# EAGLE schematic Lineboard (EAGLE 9.6.2)

## Sheet 1 of 3: Multiplexer and Connectors
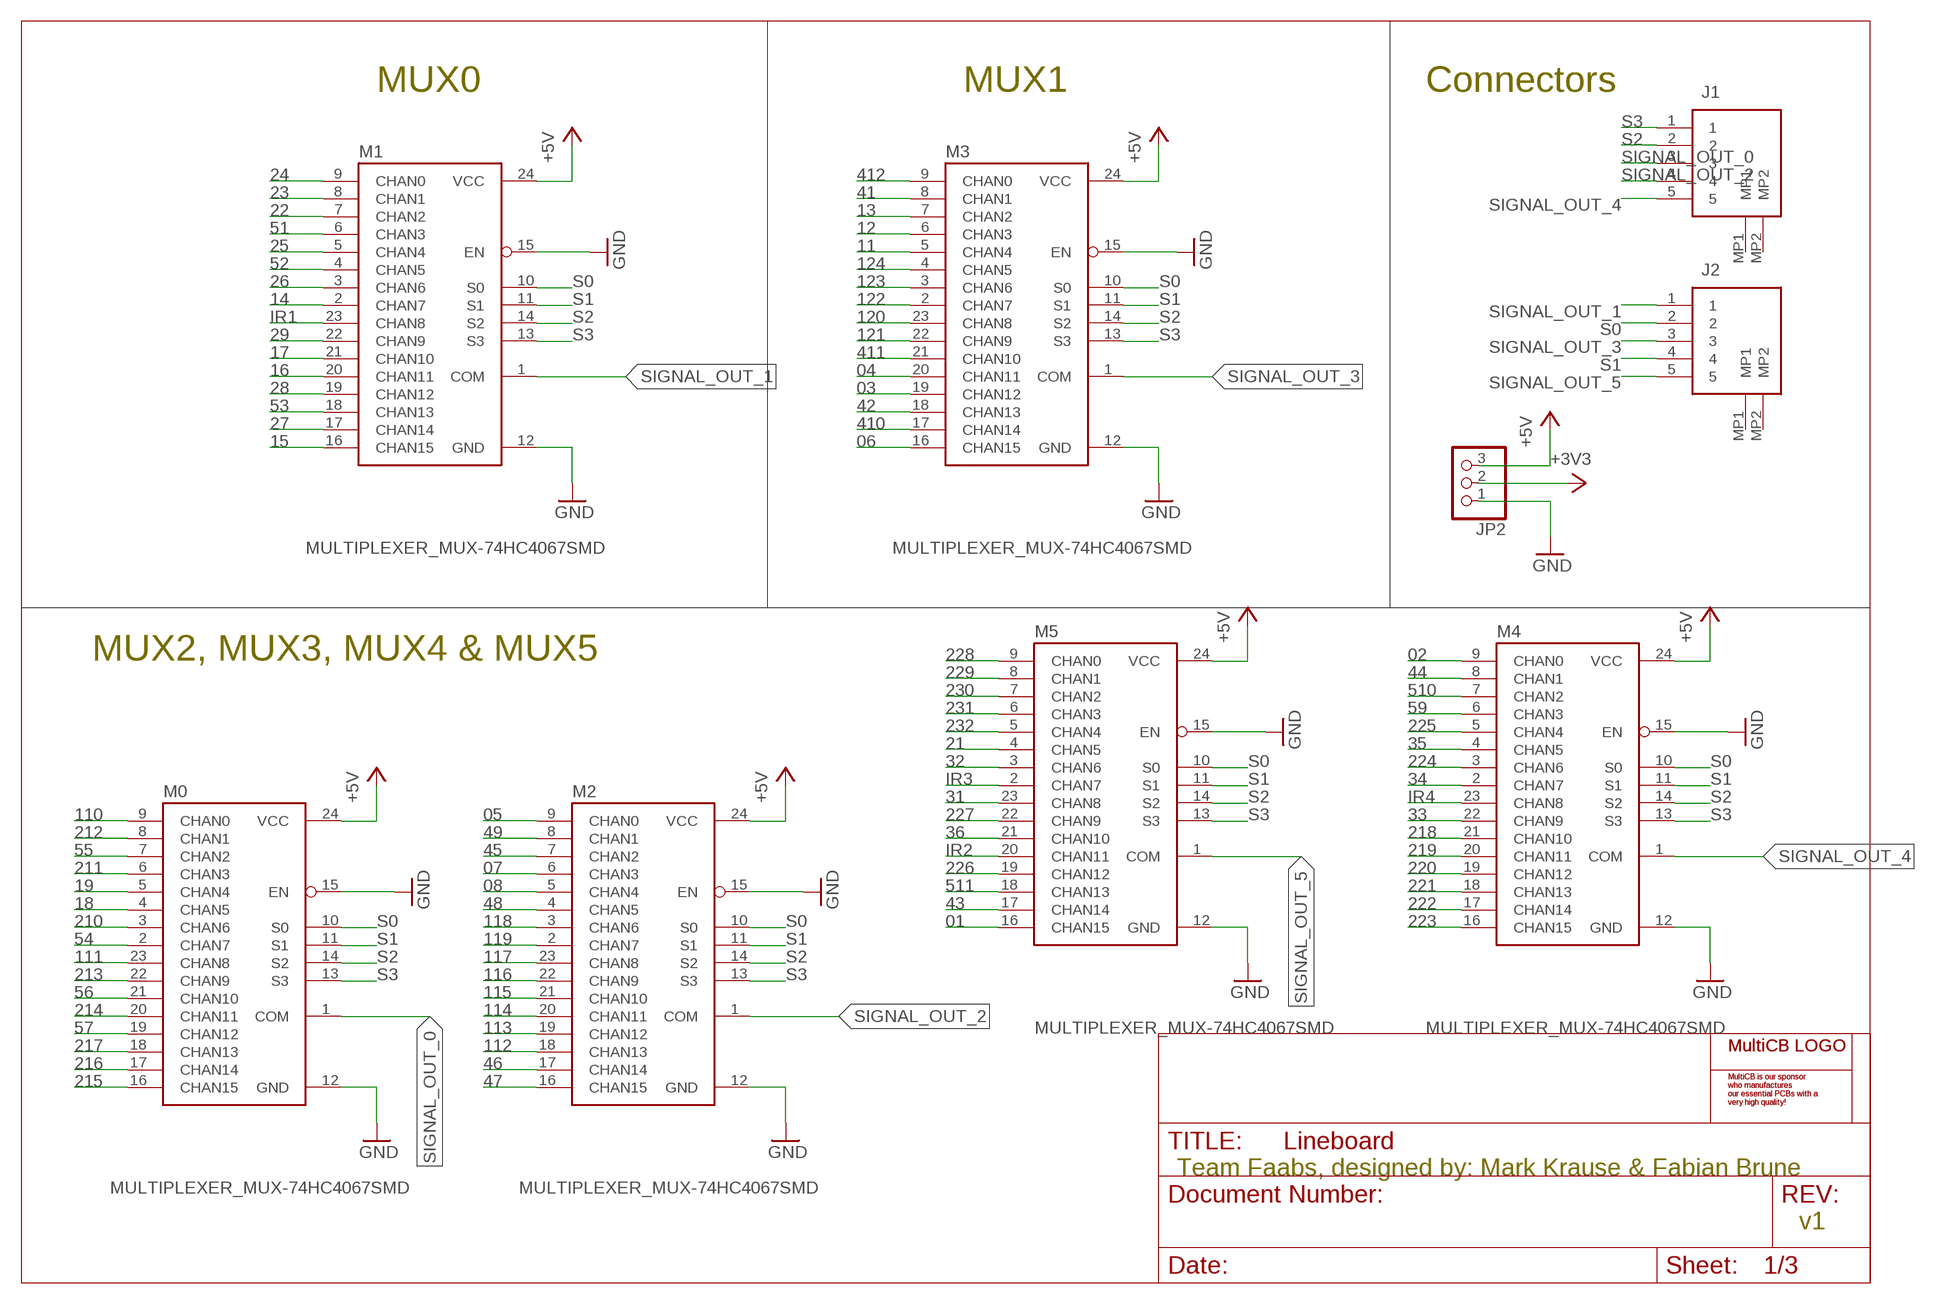
[diagram p0: schematic, sheet 1]

### Parts
J1  5PIN_1MM_CON  [2035600503]
J2  5PIN_1MM_CON  [2035600503]
JP2  PINHD-1X3  [1X03]
M0  MULTIPLEXER_MUX-74HC4067SMD  [SPARKFUN_SSOP24]
M1  MULTIPLEXER_MUX-74HC4067SMD  [SPARKFUN_SSOP24]
M2  MULTIPLEXER_MUX-74HC4067SMD  [SPARKFUN_SSOP24]
M3  MULTIPLEXER_MUX-74HC4067SMD  [SPARKFUN_SSOP24]
M4  MULTIPLEXER_MUX-74HC4067SMD  [SPARKFUN_SSOP24]
M5  MULTIPLEXER_MUX-74HC4067SMD  [SPARKFUN_SSOP24]
U$1  MULTICB_LOGOSTANDART  [SMALL_STANDARTLOGO_28MM]
U$5  MULTICB_LOGOSTANDART  [SMALL_STANDARTLOGO_28MM]

### Nets
01: M5.16(CHAN15) ; also sheet 3
02: M4.9(CHAN0) ; also sheet 3
03: M3.19(CHAN12) ; also sheet 3
04: M3.20(CHAN11) ; also sheet 3
05: M2.9(CHAN0) ; also sheet 3
06: M3.16(CHAN15) ; also sheet 3
07: M2.6(CHAN3) ; also sheet 3
08: M2.5(CHAN4) ; also sheet 3
11: M3.5(CHAN4) ; also sheet 3
12: M3.6(CHAN3) ; also sheet 3
13: M3.7(CHAN2) ; also sheet 3
14: M1.2(CHAN7) ; also sheet 3
15: M1.16(CHAN15) ; also sheet 3
16: M1.20(CHAN11) ; also sheet 3
17: M1.21(CHAN10) ; also sheet 3
18: M0.4(CHAN5) ; also sheet 3
19: M0.5(CHAN4) ; also sheet 3
21: M5.4(CHAN5) ; also sheet 3
22: M1.7(CHAN2) ; also sheet 3
23: M1.8(CHAN1) ; also sheet 3
24: M1.9(CHAN0) ; also sheet 3
25: M1.5(CHAN4) ; also sheet 3
26: M1.3(CHAN6) ; also sheet 3
27: M1.17(CHAN14) ; also sheet 3
28: M1.19(CHAN12) ; also sheet 3
29: M1.22(CHAN9) ; also sheet 3
31: M5.23(CHAN8) ; also sheet 3
32: M5.3(CHAN6) ; also sheet 3
33: M4.22(CHAN9) ; also sheet 3
34: M4.2(CHAN7) ; also sheet 3
35: M4.4(CHAN5) ; also sheet 3
36: M5.21(CHAN10) ; also sheet 3
41: M3.8(CHAN1) ; also sheet 3
42: M3.18(CHAN13) ; also sheet 3
43: M5.17(CHAN14) ; also sheet 3
44: M4.8(CHAN1) ; also sheet 3
45: M2.7(CHAN2) ; also sheet 3
46: M2.17(CHAN14) ; also sheet 3
47: M2.16(CHAN15) ; also sheet 3
48: M2.4(CHAN5) ; also sheet 3
49: M2.8(CHAN1) ; also sheet 3
51: M1.6(CHAN3) ; also sheet 3
52: M1.4(CHAN5) ; also sheet 3
53: M1.18(CHAN13) ; also sheet 3
54: M0.2(CHAN7) ; also sheet 3
55: M0.7(CHAN2) ; also sheet 3
56: M0.21(CHAN10) ; also sheet 3
57: M0.19(CHAN12) ; also sheet 3
59: M4.6(CHAN3) ; also sheet 3
110: M0.9(CHAN0) ; also sheet 3
111: M0.23(CHAN8) ; also sheet 3
112: M2.18(CHAN13) ; also sheet 3
113: M2.19(CHAN12) ; also sheet 3
114: M2.20(CHAN11) ; also sheet 3
115: M2.21(CHAN10) ; also sheet 3
116: M2.22(CHAN9) ; also sheet 3
117: M2.23(CHAN8) ; also sheet 3
118: M2.3(CHAN6) ; also sheet 3
119: M2.2(CHAN7) ; also sheet 3
120: M3.23(CHAN8) ; also sheet 3
121: M3.22(CHAN9) ; also sheet 3
122: M3.2(CHAN7) ; also sheet 3
123: M3.3(CHAN6) ; also sheet 3
124: M3.4(CHAN5) ; also sheet 3
210: M0.3(CHAN6) ; also sheet 3
211: M0.6(CHAN3) ; also sheet 3
212: M0.8(CHAN1) ; also sheet 3
213: M0.22(CHAN9) ; also sheet 3
214: M0.20(CHAN11) ; also sheet 3
215: M0.16(CHAN15) ; also sheet 3
216: M0.17(CHAN14) ; also sheet 3
217: M0.18(CHAN13) ; also sheet 3
218: M4.21(CHAN10) ; also sheet 3
219: M4.20(CHAN11) ; also sheet 3
220: M4.19(CHAN12) ; also sheet 3
221: M4.18(CHAN13) ; also sheet 3
222: M4.17(CHAN14) ; also sheet 3
223: M4.16(CHAN15) ; also sheet 3
224: M4.3(CHAN6) ; also sheet 3
225: M4.5(CHAN4) ; also sheet 3
226: M5.19(CHAN12) ; also sheet 3
227: M5.22(CHAN9) ; also sheet 3
228: M5.9(CHAN0) ; also sheet 3
229: M5.8(CHAN1) ; also sheet 3
230: M5.7(CHAN2) ; also sheet 3
231: M5.6(CHAN3) ; also sheet 3
232: M5.5(CHAN4) ; also sheet 3
410: M3.17(CHAN14) ; also sheet 3
411: M3.21(CHAN10) ; also sheet 3
412: M3.9(CHAN0) ; also sheet 3
510: M4.7(CHAN2) ; also sheet 3
511: M5.18(CHAN13) ; also sheet 3
+3V3: JP2.2 ; also sheet 2,3
+5V: JP2.3 M0.24(VCC) M1.24(VCC) M2.24(VCC) M3.24(VCC) M4.24(VCC) M5.24(VCC) ; also sheet 2
GND: JP2.1 M0.12(GND) M0.15(EN) M1.12(GND) M1.15(EN) M2.12(GND) M2.15(EN) M3.12(GND) M3.15(EN) M4.12(GND) M4.15(EN) M5.12(GND) M5.15(EN) ; also sheet 2,3
IR1: M1.23(CHAN8) ; also sheet 2
IR2: M5.20(CHAN11) ; also sheet 2
IR3: M5.2(CHAN7) ; also sheet 2
IR4: M4.23(CHAN8) ; also sheet 2
S0: J2.2 M0.10(S0) M1.10(S0) M2.10(S0) M3.10(S0) M4.10(S0) M5.10(S0)
S1: J2.4 M0.11(S1) M1.11(S1) M2.11(S1) M3.11(S1) M4.11(S1) M5.11(S1)
S2: J1.2 M0.14(S2) M1.14(S2) M2.14(S2) M3.14(S2) M4.14(S2) M5.14(S2)
S3: J1.1 M0.13(S3) M1.13(S3) M2.13(S3) M3.13(S3) M4.13(S3) M5.13(S3)
SIGNAL_OUT_0: J1.3 M0.1(COM)
SIGNAL_OUT_1: J2.1 M1.1(COM)
SIGNAL_OUT_2: J1.4 M2.1(COM)
SIGNAL_OUT_3: J2.3 M3.1(COM)
SIGNAL_OUT_4: J1.5 M4.1(COM)
SIGNAL_OUT_5: J2.5 M5.1(COM)
Unconnected: J1.MP1 J1.MP2 J2.MP1 J2.MP2

### Notes on the sheet
- MUX0 | MUX1 | Connectors
- MUX2, MUX3, MUX4 & MUX5
- Team Faabs, designed by: Mark Krause & Fabian Brune
- v1

## Sheet 2 of 3: IR-Phototransistors
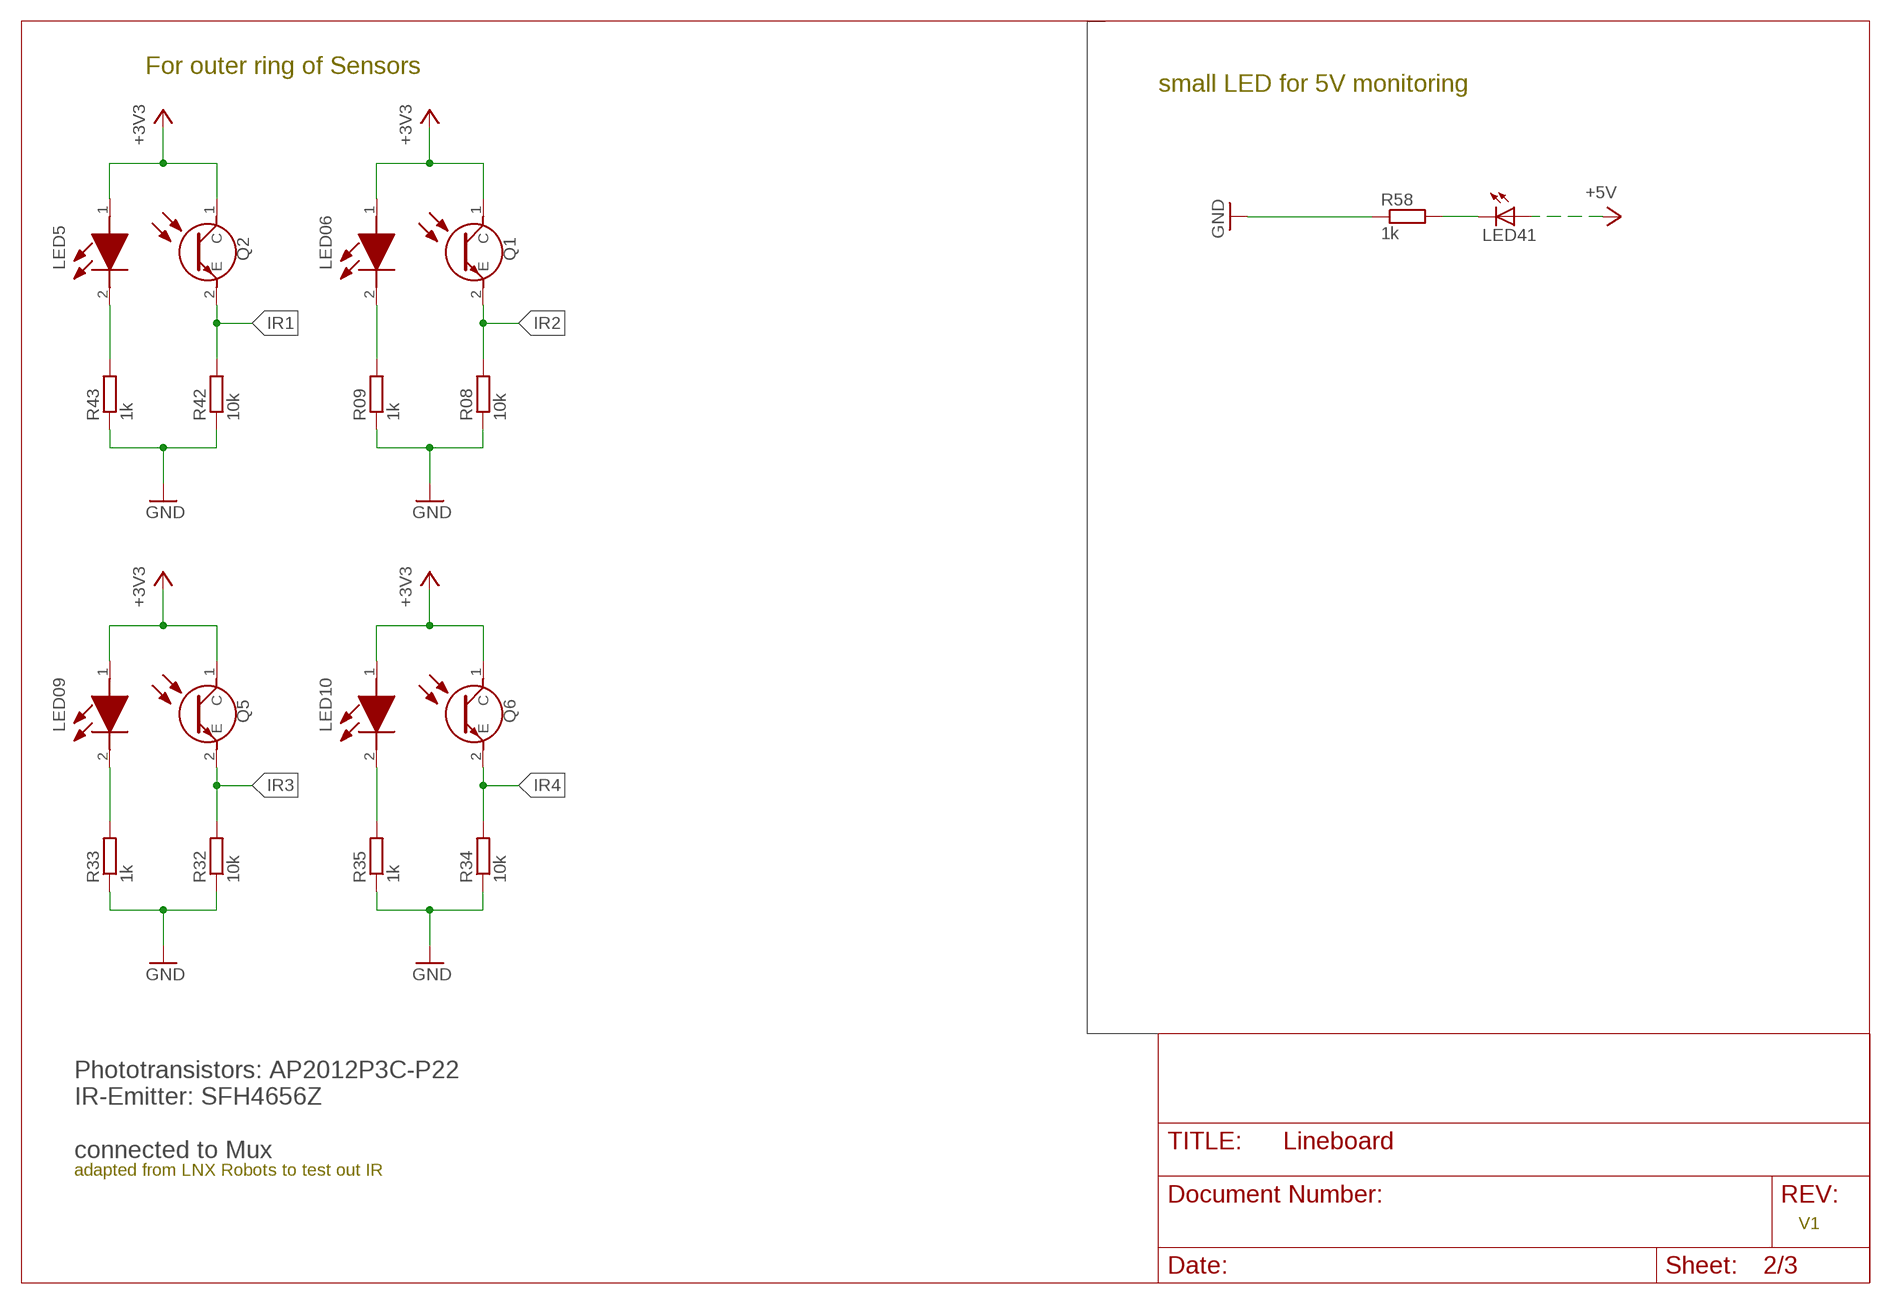
[diagram p1: schematic, sheet 2]

### Parts
LED5  SFH_4656-Z  [SFH4656Z]
LED06  SFH_4656-Z  [SFH4656Z]
LED09  SFH_4656-Z  [SFH4656Z]
LED10  SFH_4656-Z  [SFH4656Z]
LED41  POWER_LED-GREEN-CHIPLED_0805  [POWER_DISTRIBUTION_CHIPLED_0805]
Q1  AP2012P3C-P22  [AP2012P3CP22]
Q2  AP2012P3C-P22  [AP2012P3CP22]
Q5  AP2012P3C-P22  [AP2012P3CP22]
Q6  AP2012P3C-P22  [AP2012P3CP22]
R08  10k  R-EU_R0603  [R0603]
R09  1k  R-EU_R0603  [R0603]
R32  10k  R-EU_R0603  [R0603]
R33  1k  R-EU_R0603  [R0603]
R34  10k  R-EU_R0603  [R0603]
R35  1k  R-EU_R0603  [R0603]
R42  10k  R-EU_R0603  [R0603]
R43  1k  R-EU_R0603  [R0603]
R58  1k  R-EU_R0603  [R0603]

### Nets
+3V3: LED5.1(A) LED06.1(A) LED09.1(A) LED10.1(A) Q1.1(C) Q2.1(C) Q5.1(C) Q6.1(C) ; also sheet 1,3
+5V: LED41.A ; also sheet 1
GND: R08.1 R09.1 R32.1 R33.1 R34.1 R35.1 R42.1 R43.1 R58.1 ; also sheet 1,3
IR1: Q2.2(E) R42.2 ; also sheet 1
IR2: Q1.2(E) R08.2 ; also sheet 1
IR3: Q5.2(E) R32.2 ; also sheet 1
IR4: Q6.2(E) R34.2 ; also sheet 1
N$36: LED06.2(K) R09.2
N$37: LED5.2(K) R43.2
N$40: LED09.2(K) R33.2
N$41: LED10.2(K) R35.2
N$45: LED41.C R58.2

### Notes on the sheet
- For outer ring of Sensors
- small LED for 5V monitoring
- Phototransistors: AP2012P3C-P22
  IR-Emitter: SFH4656Z
  
  connected to Mux
- adapted from LNX Robots to test out IR
- V1

## Sheet 3 of 3: LED-Photostransistors
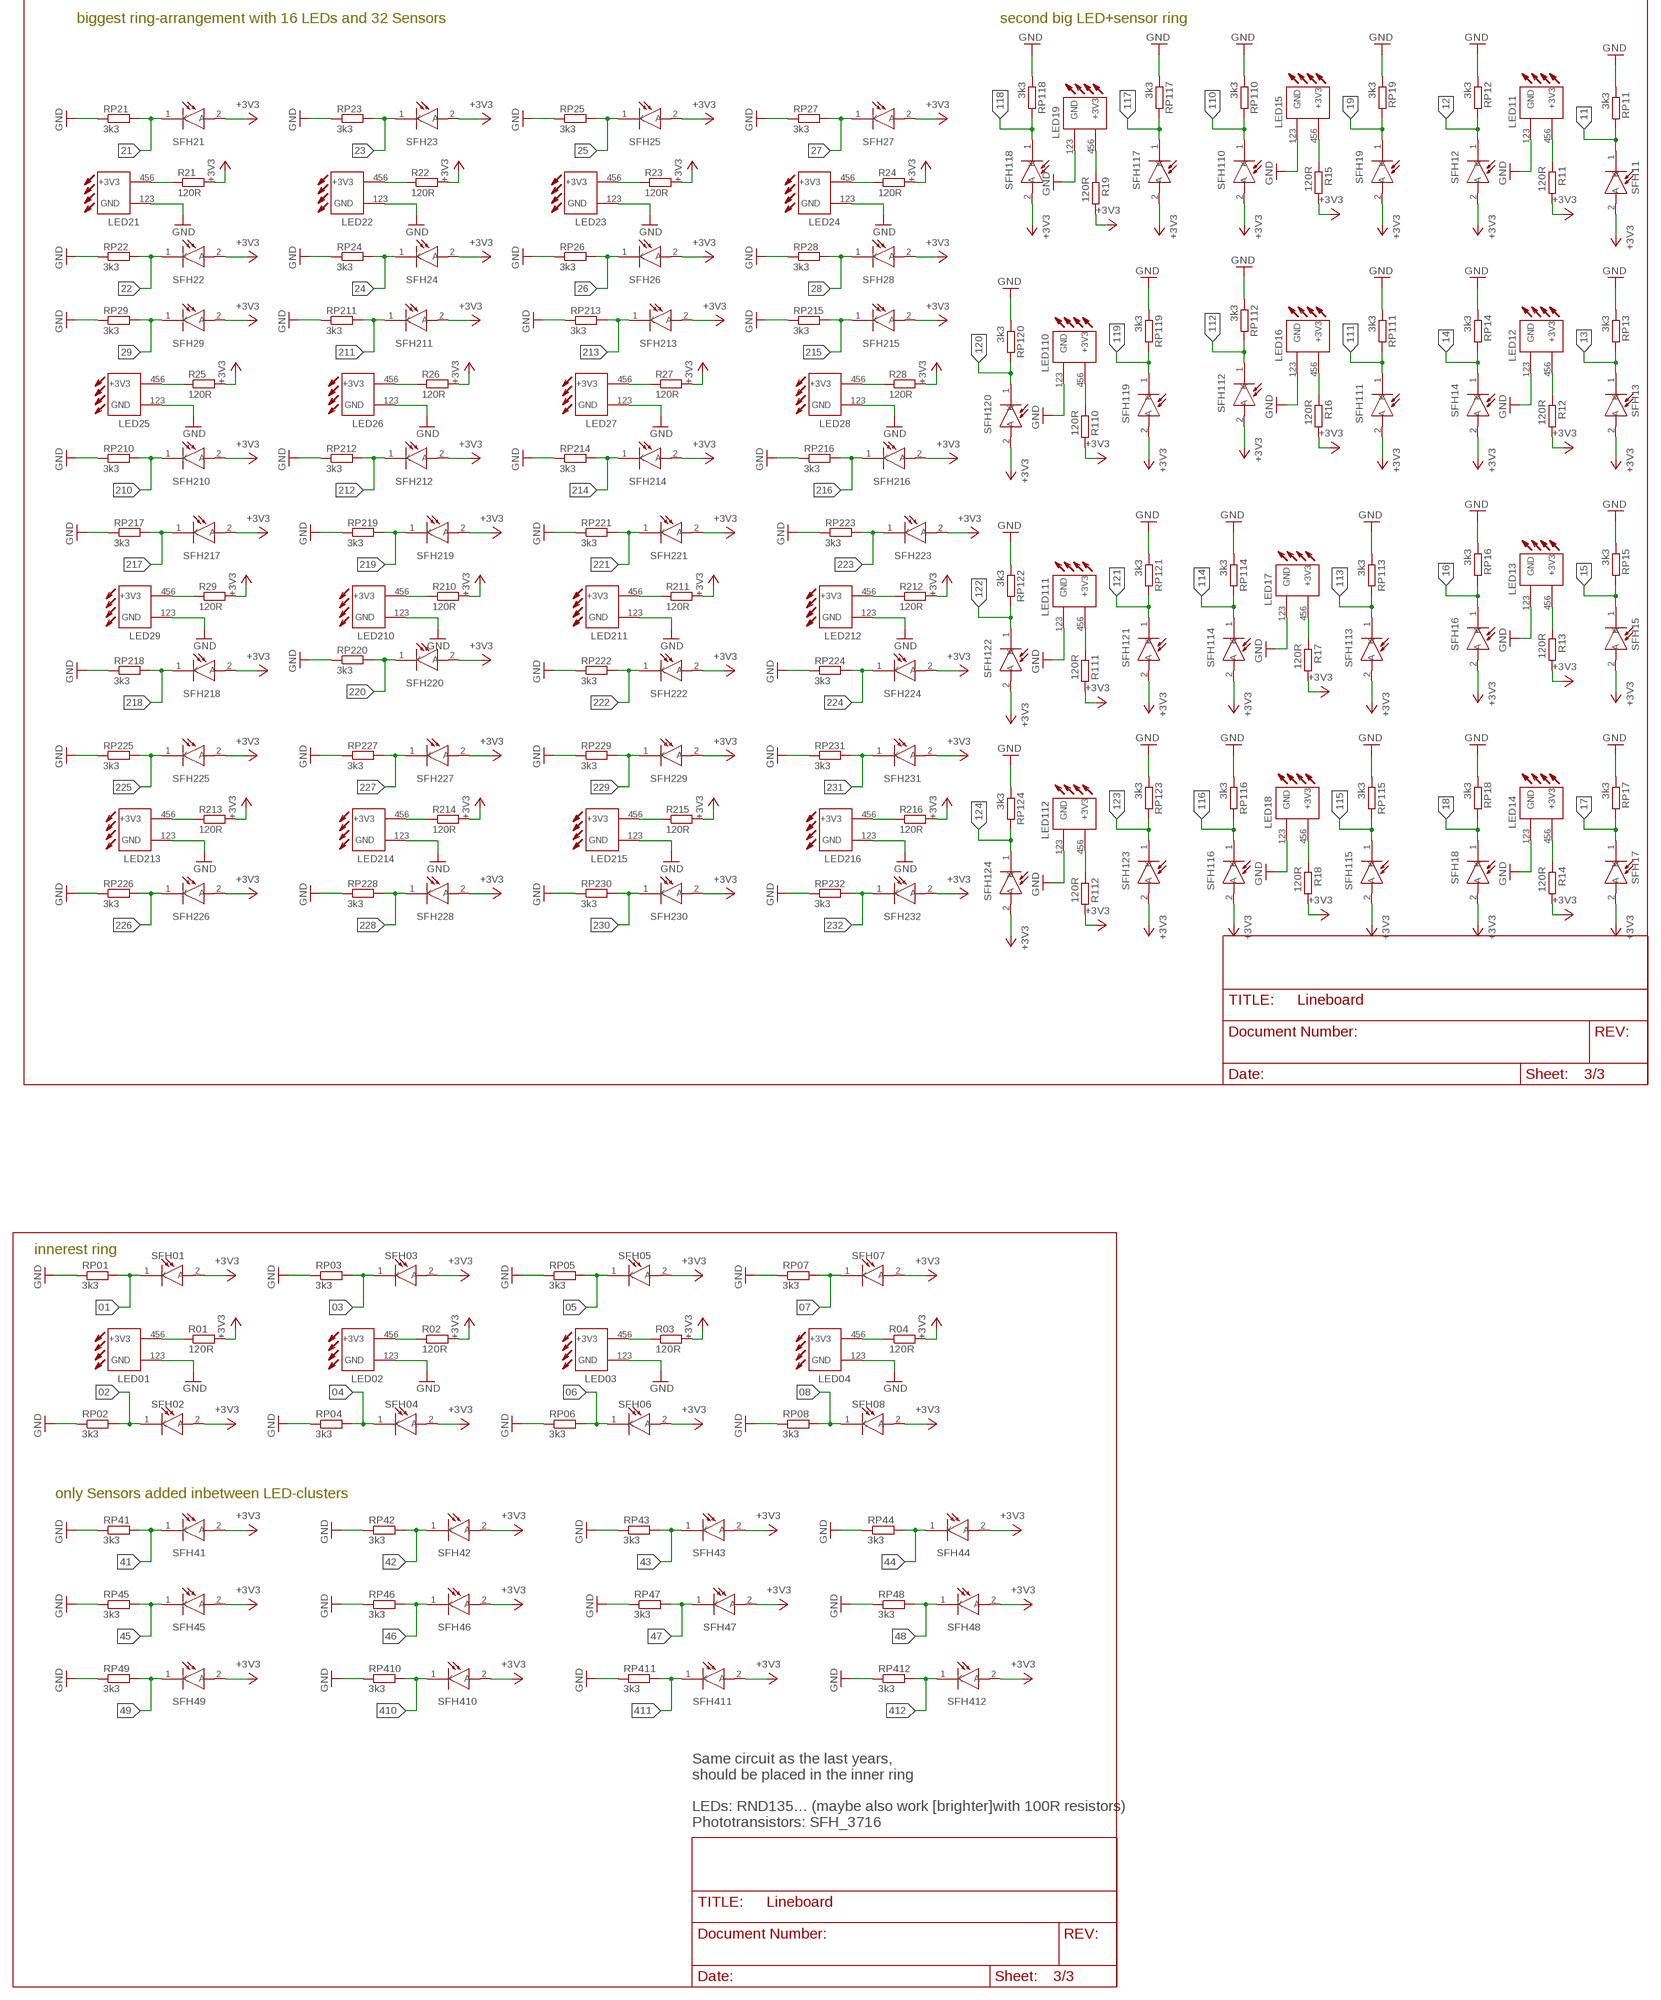
[diagram p2: schematic, sheet 3, part 1 of 2]
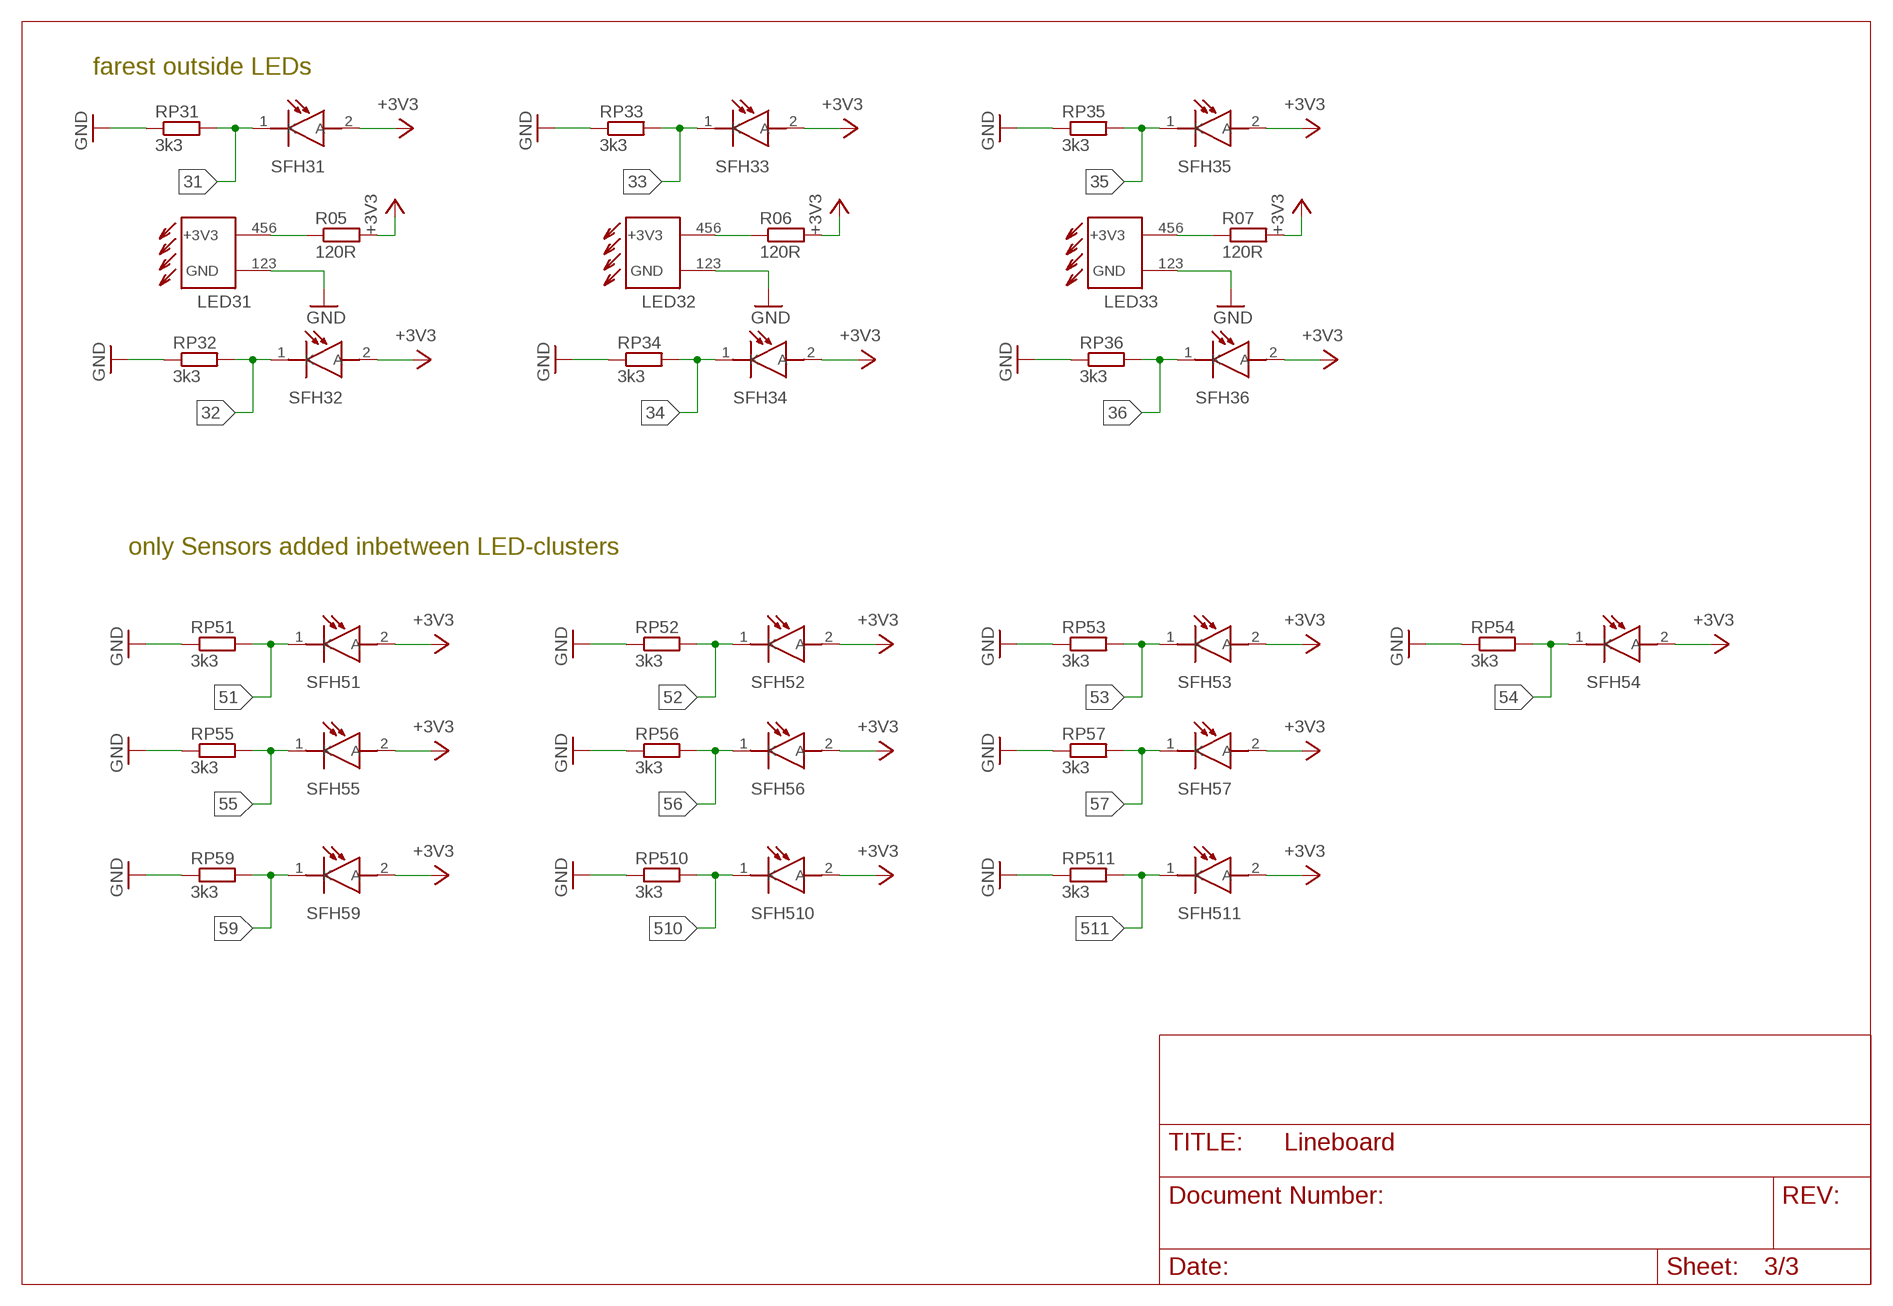
[diagram p3: schematic, sheet 3, part 2 of 2]

### Parts
LED01  RND135-00056LEDD  [LED]
LED02  RND135-00056LEDD  [LED]
LED03  RND135-00056LEDD  [LED]
LED04  RND135-00056LEDD  [LED]
LED11  RND135-00056LEDD  [LED]
LED12  RND135-00056LEDD  [LED]
LED13  RND135-00056LEDD  [LED]
LED14  RND135-00056LEDD  [LED]
LED15  RND135-00056LEDD  [LED]
LED16  RND135-00056LEDD  [LED]
LED17  RND135-00056LEDD  [LED]
LED18  RND135-00056LEDD  [LED]
LED19  RND135-00056LEDD  [LED]
LED21  RND135-00056LEDD  [LED]
LED22  RND135-00056LEDD  [LED]
LED23  RND135-00056LEDD  [LED]
LED24  RND135-00056LEDD  [LED]
LED25  RND135-00056LEDD  [LED]
LED26  RND135-00056LEDD  [LED]
LED27  RND135-00056LEDD  [LED]
LED28  RND135-00056LEDD  [LED]
LED29  RND135-00056LEDD  [LED]
LED31  RND135-00056LEDD  [LED]
LED32  RND135-00056LEDD  [LED]
LED33  RND135-00056LEDD  [LED]
LED110  RND135-00056LEDD  [LED]
LED111  RND135-00056LEDD  [LED]
LED112  RND135-00056LEDD  [LED]
LED210  RND135-00056LEDD  [LED]
LED211  RND135-00056LEDD  [LED]
LED212  RND135-00056LEDD  [LED]
LED213  RND135-00056LEDD  [LED]
LED214  RND135-00056LEDD  [LED]
LED215  RND135-00056LEDD  [LED]
LED216  RND135-00056LEDD  [LED]
R01  120R  R-EU_R0603  [R0603]
R02  120R  R-EU_R0603  [R0603]
R03  120R  R-EU_R0603  [R0603]
R04  120R  R-EU_R0603  [R0603]
R05  120R  R-EU_R0603  [R0603]
R06  120R  R-EU_R0603  [R0603]
R07  120R  R-EU_R0603  [R0603]
R11  120R  R-EU_R0603  [R0603]
R12  120R  R-EU_R0603  [R0603]
R13  120R  R-EU_R0603  [R0603]
R14  120R  R-EU_R0603  [R0603]
R15  120R  R-EU_R0603  [R0603]
R16  120R  R-EU_R0603  [R0603]
R17  120R  R-EU_R0603  [R0603]
R18  120R  R-EU_R0603  [R0603]
R19  120R  R-EU_R0603  [R0603]
R21  120R  R-EU_R0603  [R0603]
R22  120R  R-EU_R0603  [R0603]
R23  120R  R-EU_R0603  [R0603]
R24  120R  R-EU_R0603  [R0603]
R25  120R  R-EU_R0603  [R0603]
R26  120R  R-EU_R0603  [R0603]
R27  120R  R-EU_R0603  [R0603]
R28  120R  R-EU_R0603  [R0603]
R29  120R  R-EU_R0603  [R0603]
R110  120R  R-EU_R0603  [R0603]
R111  120R  R-EU_R0603  [R0603]
R112  120R  R-EU_R0603  [R0603]
R210  120R  R-EU_R0603  [R0603]
R211  120R  R-EU_R0603  [R0603]
R212  120R  R-EU_R0603  [R0603]
R213  120R  R-EU_R0603  [R0603]
R214  120R  R-EU_R0603  [R0603]
R215  120R  R-EU_R0603  [R0603]
R216  120R  R-EU_R0603  [R0603]
RP01  3k3  R-EU_R0603  [R0603]
RP02  3k3  R-EU_R0603  [R0603]
RP03  3k3  R-EU_R0603  [R0603]
RP04  3k3  R-EU_R0603  [R0603]
RP05  3k3  R-EU_R0603  [R0603]
RP06  3k3  R-EU_R0603  [R0603]
RP07  3k3  R-EU_R0603  [R0603]
RP08  3k3  R-EU_R0603  [R0603]
RP11  3k3  R-EU_R0603  [R0603]
RP12  3k3  R-EU_R0603  [R0603]
RP13  3k3  R-EU_R0603  [R0603]
RP14  3k3  R-EU_R0603  [R0603]
RP15  3k3  R-EU_R0603  [R0603]
RP16  3k3  R-EU_R0603  [R0603]
RP17  3k3  R-EU_R0603  [R0603]
RP18  3k3  R-EU_R0603  [R0603]
RP19  3k3  R-EU_R0603  [R0603]
RP21  3k3  R-EU_R0603  [R0603]
RP22  3k3  R-EU_R0603  [R0603]
RP23  3k3  R-EU_R0603  [R0603]
RP24  3k3  R-EU_R0603  [R0603]
RP25  3k3  R-EU_R0603  [R0603]
RP26  3k3  R-EU_R0603  [R0603]
RP27  3k3  R-EU_R0603  [R0603]
RP28  3k3  R-EU_R0603  [R0603]
RP29  3k3  R-EU_R0603  [R0603]
RP31  3k3  R-EU_R0603  [R0603]
RP32  3k3  R-EU_R0603  [R0603]
RP33  3k3  R-EU_R0603  [R0603]
RP34  3k3  R-EU_R0603  [R0603]
RP35  3k3  R-EU_R0603  [R0603]
RP36  3k3  R-EU_R0603  [R0603]
RP41  3k3  R-EU_R0603  [R0603]
RP42  3k3  R-EU_R0603  [R0603]
RP43  3k3  R-EU_R0603  [R0603]
RP44  3k3  R-EU_R0603  [R0603]
RP45  3k3  R-EU_R0603  [R0603]
RP46  3k3  R-EU_R0603  [R0603]
RP47  3k3  R-EU_R0603  [R0603]
RP48  3k3  R-EU_R0603  [R0603]
RP49  3k3  R-EU_R0603  [R0603]
RP51  3k3  R-EU_R0603  [R0603]
RP52  3k3  R-EU_R0603  [R0603]
RP53  3k3  R-EU_R0603  [R0603]
RP54  3k3  R-EU_R0603  [R0603]
RP55  3k3  R-EU_R0603  [R0603]
RP56  3k3  R-EU_R0603  [R0603]
RP57  3k3  R-EU_R0603  [R0603]
RP59  3k3  R-EU_R0603  [R0603]
RP110  3k3  R-EU_R0603  [R0603]
RP111  3k3  R-EU_R0603  [R0603]
RP112  3k3  R-EU_R0603  [R0603]
RP113  3k3  R-EU_R0603  [R0603]
RP114  3k3  R-EU_R0603  [R0603]
RP115  3k3  R-EU_R0603  [R0603]
RP116  3k3  R-EU_R0603  [R0603]
RP117  3k3  R-EU_R0603  [R0603]
RP118  3k3  R-EU_R0603  [R0603]
RP119  3k3  R-EU_R0603  [R0603]
RP120  3k3  R-EU_R0603  [R0603]
RP121  3k3  R-EU_R0603  [R0603]
RP122  3k3  R-EU_R0603  [R0603]
RP123  3k3  R-EU_R0603  [R0603]
RP124  3k3  R-EU_R0603  [R0603]
RP210  3k3  R-EU_R0603  [R0603]
RP211  3k3  R-EU_R0603  [R0603]
RP212  3k3  R-EU_R0603  [R0603]
RP213  3k3  R-EU_R0603  [R0603]
RP214  3k3  R-EU_R0603  [R0603]
RP215  3k3  R-EU_R0603  [R0603]
RP216  3k3  R-EU_R0603  [R0603]
RP217  3k3  R-EU_R0603  [R0603]
RP218  3k3  R-EU_R0603  [R0603]
RP219  3k3  R-EU_R0603  [R0603]
RP220  3k3  R-EU_R0603  [R0603]
RP221  3k3  R-EU_R0603  [R0603]
RP222  3k3  R-EU_R0603  [R0603]
RP223  3k3  R-EU_R0603  [R0603]
RP224  3k3  R-EU_R0603  [R0603]
RP225  3k3  R-EU_R0603  [R0603]
RP226  3k3  R-EU_R0603  [R0603]
RP227  3k3  R-EU_R0603  [R0603]
RP228  3k3  R-EU_R0603  [R0603]
RP229  3k3  R-EU_R0603  [R0603]
RP230  3k3  R-EU_R0603  [R0603]
RP231  3k3  R-EU_R0603  [R0603]
RP232  3k3  R-EU_R0603  [R0603]
RP410  3k3  R-EU_R0603  [R0603]
RP411  3k3  R-EU_R0603  [R0603]
RP412  3k3  R-EU_R0603  [R0603]
RP510  3k3  R-EU_R0603  [R0603]
RP511  3k3  R-EU_R0603  [R0603]
SFH01  SFH_3716  [LEDC2012X89N]
SFH02  SFH_3716  [LEDC2012X89N]
SFH03  SFH_3716  [LEDC2012X89N]
SFH04  SFH_3716  [LEDC2012X89N]
SFH05  SFH_3716  [LEDC2012X89N]
SFH06  SFH_3716  [LEDC2012X89N]
SFH07  SFH_3716  [LEDC2012X89N]
SFH08  SFH_3716  [LEDC2012X89N]
SFH11  SFH_3716  [LEDC2012X89N]
SFH12  SFH_3716  [LEDC2012X89N]
SFH13  SFH_3716  [LEDC2012X89N]
SFH14  SFH_3716  [LEDC2012X89N]
SFH15  SFH_3716  [LEDC2012X89N]
SFH16  SFH_3716  [LEDC2012X89N]
SFH17  SFH_3716  [LEDC2012X89N]
SFH18  SFH_3716  [LEDC2012X89N]
SFH19  SFH_3716  [LEDC2012X89N]
SFH21  SFH_3716  [LEDC2012X89N]
SFH22  SFH_3716  [LEDC2012X89N]
SFH23  SFH_3716  [LEDC2012X89N]
SFH24  SFH_3716  [LEDC2012X89N]
SFH25  SFH_3716  [LEDC2012X89N]
SFH26  SFH_3716  [LEDC2012X89N]
SFH27  SFH_3716  [LEDC2012X89N]
SFH28  SFH_3716  [LEDC2012X89N]
SFH29  SFH_3716  [LEDC2012X89N]
SFH31  SFH_3716  [LEDC2012X89N]
SFH32  SFH_3716  [LEDC2012X89N]
SFH33  SFH_3716  [LEDC2012X89N]
SFH34  SFH_3716  [LEDC2012X89N]
SFH35  SFH_3716  [LEDC2012X89N]
SFH36  SFH_3716  [LEDC2012X89N]
SFH41  SFH_3716  [LEDC2012X89N]
SFH42  SFH_3716  [LEDC2012X89N]
SFH43  SFH_3716  [LEDC2012X89N]
SFH44  SFH_3716  [LEDC2012X89N]
SFH45  SFH_3716  [LEDC2012X89N]
SFH46  SFH_3716  [LEDC2012X89N]
SFH47  SFH_3716  [LEDC2012X89N]
SFH48  SFH_3716  [LEDC2012X89N]
SFH49  SFH_3716  [LEDC2012X89N]
SFH51  SFH_3716  [LEDC2012X89N]
SFH52  SFH_3716  [LEDC2012X89N]
SFH53  SFH_3716  [LEDC2012X89N]
SFH54  SFH_3716  [LEDC2012X89N]
SFH55  SFH_3716  [LEDC2012X89N]
SFH56  SFH_3716  [LEDC2012X89N]
SFH57  SFH_3716  [LEDC2012X89N]
SFH59  SFH_3716  [LEDC2012X89N]
SFH110  SFH_3716  [LEDC2012X89N]
SFH111  SFH_3716  [LEDC2012X89N]
SFH112  SFH_3716  [LEDC2012X89N]
SFH113  SFH_3716  [LEDC2012X89N]
SFH114  SFH_3716  [LEDC2012X89N]
SFH115  SFH_3716  [LEDC2012X89N]
SFH116  SFH_3716  [LEDC2012X89N]
SFH117  SFH_3716  [LEDC2012X89N]
SFH118  SFH_3716  [LEDC2012X89N]
SFH119  SFH_3716  [LEDC2012X89N]
SFH120  SFH_3716  [LEDC2012X89N]
SFH121  SFH_3716  [LEDC2012X89N]
SFH122  SFH_3716  [LEDC2012X89N]
SFH123  SFH_3716  [LEDC2012X89N]
SFH124  SFH_3716  [LEDC2012X89N]
SFH210  SFH_3716  [LEDC2012X89N]
SFH211  SFH_3716  [LEDC2012X89N]
SFH212  SFH_3716  [LEDC2012X89N]
SFH213  SFH_3716  [LEDC2012X89N]
SFH214  SFH_3716  [LEDC2012X89N]
SFH215  SFH_3716  [LEDC2012X89N]
SFH216  SFH_3716  [LEDC2012X89N]
SFH217  SFH_3716  [LEDC2012X89N]
SFH218  SFH_3716  [LEDC2012X89N]
SFH219  SFH_3716  [LEDC2012X89N]
SFH220  SFH_3716  [LEDC2012X89N]
SFH221  SFH_3716  [LEDC2012X89N]
SFH222  SFH_3716  [LEDC2012X89N]
SFH223  SFH_3716  [LEDC2012X89N]
SFH224  SFH_3716  [LEDC2012X89N]
SFH225  SFH_3716  [LEDC2012X89N]
SFH226  SFH_3716  [LEDC2012X89N]
SFH227  SFH_3716  [LEDC2012X89N]
SFH228  SFH_3716  [LEDC2012X89N]
SFH229  SFH_3716  [LEDC2012X89N]
SFH230  SFH_3716  [LEDC2012X89N]
SFH231  SFH_3716  [LEDC2012X89N]
SFH232  SFH_3716  [LEDC2012X89N]
SFH410  SFH_3716  [LEDC2012X89N]
SFH411  SFH_3716  [LEDC2012X89N]
SFH412  SFH_3716  [LEDC2012X89N]
SFH510  SFH_3716  [LEDC2012X89N]
SFH511  SFH_3716  [LEDC2012X89N]

### Nets
01: RP01.2 SFH01.1(K) ; also sheet 1
02: RP02.2 SFH02.1(K) ; also sheet 1
03: RP03.2 SFH03.1(K) ; also sheet 1
04: RP04.2 SFH04.1(K) ; also sheet 1
05: RP05.2 SFH05.1(K) ; also sheet 1
06: RP06.2 SFH06.1(K) ; also sheet 1
07: RP07.2 SFH07.1(K) ; also sheet 1
08: RP08.2 SFH08.1(K) ; also sheet 1
11: RP11.2 SFH11.1(K) ; also sheet 1
12: RP12.2 SFH12.1(K) ; also sheet 1
13: RP13.2 SFH13.1(K) ; also sheet 1
14: RP14.2 SFH14.1(K) ; also sheet 1
15: RP15.2 SFH15.1(K) ; also sheet 1
16: RP16.2 SFH16.1(K) ; also sheet 1
17: RP17.2 SFH17.1(K) ; also sheet 1
18: RP18.2 SFH18.1(K) ; also sheet 1
19: RP19.2 SFH19.1(K) ; also sheet 1
21: RP21.2 SFH21.1(K) ; also sheet 1
22: RP22.2 SFH22.1(K) ; also sheet 1
23: RP23.2 SFH23.1(K) ; also sheet 1
24: RP24.2 SFH24.1(K) ; also sheet 1
25: RP25.2 SFH25.1(K) ; also sheet 1
26: RP26.2 SFH26.1(K) ; also sheet 1
27: RP27.2 SFH27.1(K) ; also sheet 1
28: RP28.2 SFH28.1(K) ; also sheet 1
29: RP29.2 SFH29.1(K) ; also sheet 1
31: RP31.2 SFH31.1(K) ; also sheet 1
32: RP32.2 SFH32.1(K) ; also sheet 1
33: RP33.2 SFH33.1(K) ; also sheet 1
34: RP34.2 SFH34.1(K) ; also sheet 1
35: RP35.2 SFH35.1(K) ; also sheet 1
36: RP36.2 SFH36.1(K) ; also sheet 1
41: RP41.2 SFH41.1(K) ; also sheet 1
42: RP42.2 SFH42.1(K) ; also sheet 1
43: RP43.2 SFH43.1(K) ; also sheet 1
44: RP44.2 SFH44.1(K) ; also sheet 1
45: RP45.2 SFH45.1(K) ; also sheet 1
46: RP46.2 SFH46.1(K) ; also sheet 1
47: RP47.2 SFH47.1(K) ; also sheet 1
48: RP48.2 SFH48.1(K) ; also sheet 1
49: RP49.2 SFH49.1(K) ; also sheet 1
51: RP51.2 SFH51.1(K) ; also sheet 1
52: RP52.2 SFH52.1(K) ; also sheet 1
53: RP53.2 SFH53.1(K) ; also sheet 1
54: RP54.2 SFH54.1(K) ; also sheet 1
55: RP55.2 SFH55.1(K) ; also sheet 1
56: RP56.2 SFH56.1(K) ; also sheet 1
57: RP57.2 SFH57.1(K) ; also sheet 1
59: RP59.2 SFH59.1(K) ; also sheet 1
110: RP110.2 SFH110.1(K) ; also sheet 1
111: RP111.2 SFH111.1(K) ; also sheet 1
112: RP112.2 SFH112.1(K) ; also sheet 1
113: RP113.2 SFH113.1(K) ; also sheet 1
114: RP114.2 SFH114.1(K) ; also sheet 1
115: RP115.2 SFH115.1(K) ; also sheet 1
116: RP116.2 SFH116.1(K) ; also sheet 1
117: RP117.2 SFH117.1(K) ; also sheet 1
118: RP118.2 SFH118.1(K) ; also sheet 1
119: RP119.2 SFH119.1(K) ; also sheet 1
120: RP120.2 SFH120.1(K) ; also sheet 1
121: RP121.2 SFH121.1(K) ; also sheet 1
122: RP122.2 SFH122.1(K) ; also sheet 1
123: RP123.2 SFH123.1(K) ; also sheet 1
124: RP124.2 SFH124.1(K) ; also sheet 1
210: RP210.2 SFH210.1(K) ; also sheet 1
211: RP211.2 SFH211.1(K) ; also sheet 1
212: RP212.2 SFH212.1(K) ; also sheet 1
213: RP213.2 SFH213.1(K) ; also sheet 1
214: RP214.2 SFH214.1(K) ; also sheet 1
215: RP215.2 SFH215.1(K) ; also sheet 1
216: RP216.2 SFH216.1(K) ; also sheet 1
217: RP217.2 SFH217.1(K) ; also sheet 1
218: RP218.2 SFH218.1(K) ; also sheet 1
219: RP219.2 SFH219.1(K) ; also sheet 1
220: RP220.2 SFH220.1(K) ; also sheet 1
221: RP221.2 SFH221.1(K) ; also sheet 1
222: RP222.2 SFH222.1(K) ; also sheet 1
223: RP223.2 SFH223.1(K) ; also sheet 1
224: RP224.2 SFH224.1(K) ; also sheet 1
225: RP225.2 SFH225.1(K) ; also sheet 1
226: RP226.2 SFH226.1(K) ; also sheet 1
227: RP227.2 SFH227.1(K) ; also sheet 1
228: RP228.2 SFH228.1(K) ; also sheet 1
229: RP229.2 SFH229.1(K) ; also sheet 1
230: RP230.2 SFH230.1(K) ; also sheet 1
231: RP231.2 SFH231.1(K) ; also sheet 1
232: RP232.2 SFH232.1(K) ; also sheet 1
410: RP410.2 SFH410.1(K) ; also sheet 1
411: RP411.2 SFH411.1(K) ; also sheet 1
412: RP412.2 SFH412.1(K) ; also sheet 1
510: RP510.2 SFH510.1(K) ; also sheet 1
511: RP511.2 SFH511.1(K) ; also sheet 1
+3V3: R01.2 R02.2 R03.2 R04.2 R05.2 R06.2 R07.2 R11.2 R12.2 R13.2 R14.2 R15.2 R16.2 R17.2 R18.2 R19.2 R21.2 R22.2 R23.2 R24.2 R25.2 R26.2 R27.2 R28.2 R29.2 R110.2 R111.2 R112.2 R210.2 R211.2 R212.2 R213.2 R214.2 R215.2 R216.2 SFH01.2(A) SFH02.2(A) SFH03.2(A) SFH04.2(A) SFH05.2(A) SFH06.2(A) SFH07.2(A) SFH08.2(A) SFH11.2(A) SFH12.2(A) SFH13.2(A) SFH14.2(A) SFH15.2(A) SFH16.2(A) SFH17.2(A) SFH18.2(A) SFH19.2(A) SFH21.2(A) SFH22.2(A) SFH23.2(A) SFH24.2(A) SFH25.2(A) SFH26.2(A) SFH27.2(A) SFH28.2(A) SFH29.2(A) SFH31.2(A) SFH32.2(A) SFH33.2(A) SFH34.2(A) SFH35.2(A) SFH36.2(A) SFH41.2(A) SFH42.2(A) SFH43.2(A) SFH44.2(A) SFH45.2(A) SFH46.2(A) SFH47.2(A) SFH48.2(A) SFH49.2(A) SFH51.2(A) SFH52.2(A) SFH53.2(A) SFH54.2(A) SFH55.2(A) SFH56.2(A) SFH57.2(A) SFH59.2(A) SFH110.2(A) SFH111.2(A) SFH112.2(A) SFH113.2(A) SFH114.2(A) SFH115.2(A) SFH116.2(A) SFH117.2(A) SFH118.2(A) SFH119.2(A) SFH120.2(A) SFH121.2(A) SFH122.2(A) SFH123.2(A) SFH124.2(A) SFH210.2(A) SFH211.2(A) SFH212.2(A) SFH213.2(A) SFH214.2(A) SFH215.2(A) SFH216.2(A) SFH217.2(A) SFH218.2(A) SFH219.2(A) SFH220.2(A) SFH221.2(A) SFH222.2(A) SFH223.2(A) SFH224.2(A) SFH225.2(A) SFH226.2(A) SFH227.2(A) SFH228.2(A) SFH229.2(A) SFH230.2(A) SFH231.2(A) SFH232.2(A) SFH410.2(A) SFH411.2(A) SFH412.2(A) SFH510.2(A) SFH511.2(A) ; also sheet 1,2
GND: LED01.123(GND) LED02.123(GND) LED03.123(GND) LED04.123(GND) LED11.123(GND) LED12.123(GND) LED13.123(GND) LED14.123(GND) LED15.123(GND) LED16.123(GND) LED17.123(GND) LED18.123(GND) LED19.123(GND) LED21.123(GND) LED22.123(GND) LED23.123(GND) LED24.123(GND) LED25.123(GND) LED26.123(GND) LED27.123(GND) LED28.123(GND) LED29.123(GND) LED31.123(GND) LED32.123(GND) LED33.123(GND) LED110.123(GND) LED111.123(GND) LED112.123(GND) LED210.123(GND) LED211.123(GND) LED212.123(GND) LED213.123(GND) LED214.123(GND) LED215.123(GND) LED216.123(GND) RP01.1 RP02.1 RP03.1 RP04.1 RP05.1 RP06.1 RP07.1 RP08.1 RP11.1 RP12.1 RP13.1 RP14.1 RP15.1 RP16.1 RP17.1 RP18.1 RP19.1 RP21.1 RP22.1 RP23.1 RP24.1 RP25.1 RP26.1 RP27.1 RP28.1 RP29.1 RP31.1 RP32.1 RP33.1 RP34.1 RP35.1 RP36.1 RP41.1 RP42.1 RP43.1 RP44.1 RP45.1 RP46.1 RP47.1 RP48.1 RP49.1 RP51.1 RP52.1 RP53.1 RP54.1 RP55.1 RP56.1 RP57.1 RP59.1 RP110.1 RP111.1 RP112.1 RP113.1 RP114.1 RP115.1 RP116.1 RP117.1 RP118.1 RP119.1 RP120.1 RP121.1 RP122.1 RP123.1 RP124.1 RP210.1 RP211.1 RP212.1 RP213.1 RP214.1 RP215.1 RP216.1 RP217.1 RP218.1 RP219.1 RP220.1 RP221.1 RP222.1 RP223.1 RP224.1 RP225.1 RP226.1 RP227.1 RP228.1 RP229.1 RP230.1 RP231.1 RP232.1 RP410.1 RP411.1 RP412.1 RP510.1 RP511.1 ; also sheet 1,2
N$1: LED11.456(+3V3) R11.1
N$2: LED12.456(+3V3) R12.1
N$3: LED13.456(+3V3) R13.1
N$4: LED14.456(+3V3) R14.1
N$5: LED15.456(+3V3) R15.1
N$6: LED16.456(+3V3) R16.1
N$7: LED17.456(+3V3) R17.1
N$8: LED18.456(+3V3) R18.1
N$9: LED19.456(+3V3) R19.1
N$10: LED110.456(+3V3) R110.1
N$11: LED111.456(+3V3) R111.1
N$12: LED112.456(+3V3) R112.1
N$13: LED21.456(+3V3) R21.1
N$14: LED22.456(+3V3) R22.1
N$15: LED23.456(+3V3) R23.1
N$16: LED24.456(+3V3) R24.1
N$17: LED25.456(+3V3) R25.1
N$18: LED26.456(+3V3) R26.1
N$19: LED27.456(+3V3) R27.1
N$20: LED28.456(+3V3) R28.1
N$21: LED01.456(+3V3) R01.1
N$22: LED02.456(+3V3) R02.1
N$23: LED03.456(+3V3) R03.1
N$24: LED04.456(+3V3) R04.1
N$25: LED29.456(+3V3) R29.1
N$26: LED210.456(+3V3) R210.1
N$27: LED211.456(+3V3) R211.1
N$28: LED212.456(+3V3) R212.1
N$29: LED213.456(+3V3) R213.1
N$30: LED214.456(+3V3) R214.1
N$31: LED215.456(+3V3) R215.1
N$32: LED216.456(+3V3) R216.1
N$33: LED31.456(+3V3) R05.1
N$34: LED32.456(+3V3) R06.1
N$35: LED33.456(+3V3) R07.1

### Notes on the sheet
- farest outside LEDs
- biggest ring-arrangement with 16 LEDs and 32 Sensors | second big LED+sensor ring
- only Sensors added inbetween LED-clusters
- innerest ring
- only Sensors added inbetween LED-clusters
- Same circuit as the last years,
  should be placed in the inner ring
  
  LEDs: RND135... (maybe also work [brighter]with 100R resistors)
  Phototransistors: SFH_3716

## Library data of the parts
J1 J2 = 5PinConnector:5PIN_1MM_CON: Headers & Wire Housings PicoClasp Hdr SMT SR Vrt 5Ckt OPL Au0.38 Source: Datasheet <https://www.molex.com/pdm_docs/sd/2035600503_sd.pdf>; DESCRIPTION: Headers & Wire Housings PicoClasp Hdr SMT SR Vrt 5Ckt OPL Au0.38; HEIGHT: 5.61mm; MANUFACTURER_NAME: Molex; MANUFACTURER_PART_NUMBER: 203560-0503; MOUSER_PART_NUMBER: 538-203560-0503; MOUSER_PRICE-STOCK: https://www.mouser.co.uk/ProductDetail/Molex/203560-0503?qs=F5EMLAvA7IDMlfZodDQB8w%3D%3D
JP2 = pinhead:PINHD-1X3: PIN HEADER
LED01-LED04 LED11-LED19 LED21-LED29 LED31-LED33 LED110-LED112 LED210-LED216 = RND_135-00056:RND135-00056LED
LED5 LED06 LED09 LED10 = SFH_4656-Z:SFH_4656-Z: Infrared Emitters - High Power 850 nm MIDLED Source: Datasheet <https://dammedia.osram.info/media/resource/hires/osram-dam-16623498/SFH 4656_CN.pdf>; DESCRIPTION: Infrared Emitters - High Power 850 nm MIDLED; HEIGHT: 1.7mm; MANUFACTURER_NAME: OSRAM; MANUFACTURER_PART_NUMBER: SFH 4656-Z; MOUSER_PART_NUMBER: 720-SFH4656-Z; MOUSER_PRICE-STOCK: http://www.mouser.com/Search/ProductDetail.aspx?qs=KeLXQb9Uup2X3iF4LUEobw%3d%3d
LED41 = Open24:POWER_LED: LED; MF: Würth Elektronik; MPN: 150080GS75000
M0 M1-M5 = Open24:MULTIPLEXER_MUX-74HC4067
Q1 Q2 Q5 Q6 = AP2012P3C-P22:AP2012P3C-P22: Phototransistors 2x1.2mm PHOTOTRANS SMD LED Source: Datasheet <http://www.kingbrightusa.com/images/catalog/SPEC/AP2012P3C-P22.pdf>; ARROW_PART_NUMBER: AP2012P3C-P22; ARROW_PRICE-STOCK: https://www.arrow.com/en/products/ap2012p3c-p22/kingbright; DESCRIPTION: Phototransistors 2x1.2mm PHOTOTRANS SMD LED; HEIGHT: 1.1mm; MANUFACTURER_NAME: Kingbright; MANUFACTURER_PART_NUMBER: AP2012P3C-P22; MOUSER_PART_NUMBER: 604-AP2012P3C-P22; MOUSER_PRICE-STOCK: https://www.mouser.com/Search/Refine.aspx?Keyword=604-AP2012P3C-P22
R01-R09 R11-R19 R21-R29 R32-R35 R42 R43 R58 R110-R112 R210-R216 RP01-RP08 RP11-RP19 RP21-RP29 RP31-RP36 RP41-RP49 RP51-RP57 RP59 RP110-RP124 RP210-RP232 RP410-RP412 RP510 RP511 = rcl:R-EU_: RESISTOR, European symbol; SPICEPREFIX: R
SFH01-SFH08 SFH11-SFH19 SFH21-SFH29 SFH31-SFH36 SFH41-SFH49 SFH51-SFH57 SFH59 SFH110-SFH124 SFH210-SFH232 SFH410-SFH412 SFH510 SFH511 = SamacSys_Parts:SFH_3716: Osram Opto SFH 3716 Ambient Light Sensor Unit Surface Mount 2-Pin Source: Datasheet <https://dammedia.osram.info/media/resource/hires/osram-dam-2496086/SFH 3716.pdf>; DESCRIPTION: Osram Opto SFH 3716 Ambient Light Sensor Unit Surface Mount 2-Pin; HEIGHT: 0.89mm; MANUFACTURER_NAME: OSRAM Opto Semiconductors; MANUFACTURER_PART_NUMBER: SFH 3716; MOUSER_PART_NUMBER: 720-SFH3716; MOUSER_PRICE-STOCK: https://www.mouser.com/Search/Refine.aspx?Keyword=720-SFH3716; RS_PART_NUMBER: 1115952P; RS_PRICE-STOCK: http://uk.rs-online.com/web/p/products/1115952P
U$1 U$5 = MultiCB_logos:MULTICB_LOGO

## Net classes
1 5v: width 0.813 mm, drill 0.8 mm